# EasyEDA Pro project WS2811-22_2024-06-16.epro

# Schematic Schematic1
Create Date: 2024-06-16; Page Name: P1; Project Name: RGB22; Schematic Name: Schematic1; Update Date: 2024-06-16; Company: 嘉立创EDA; Page Size: A4; Version: V1.0
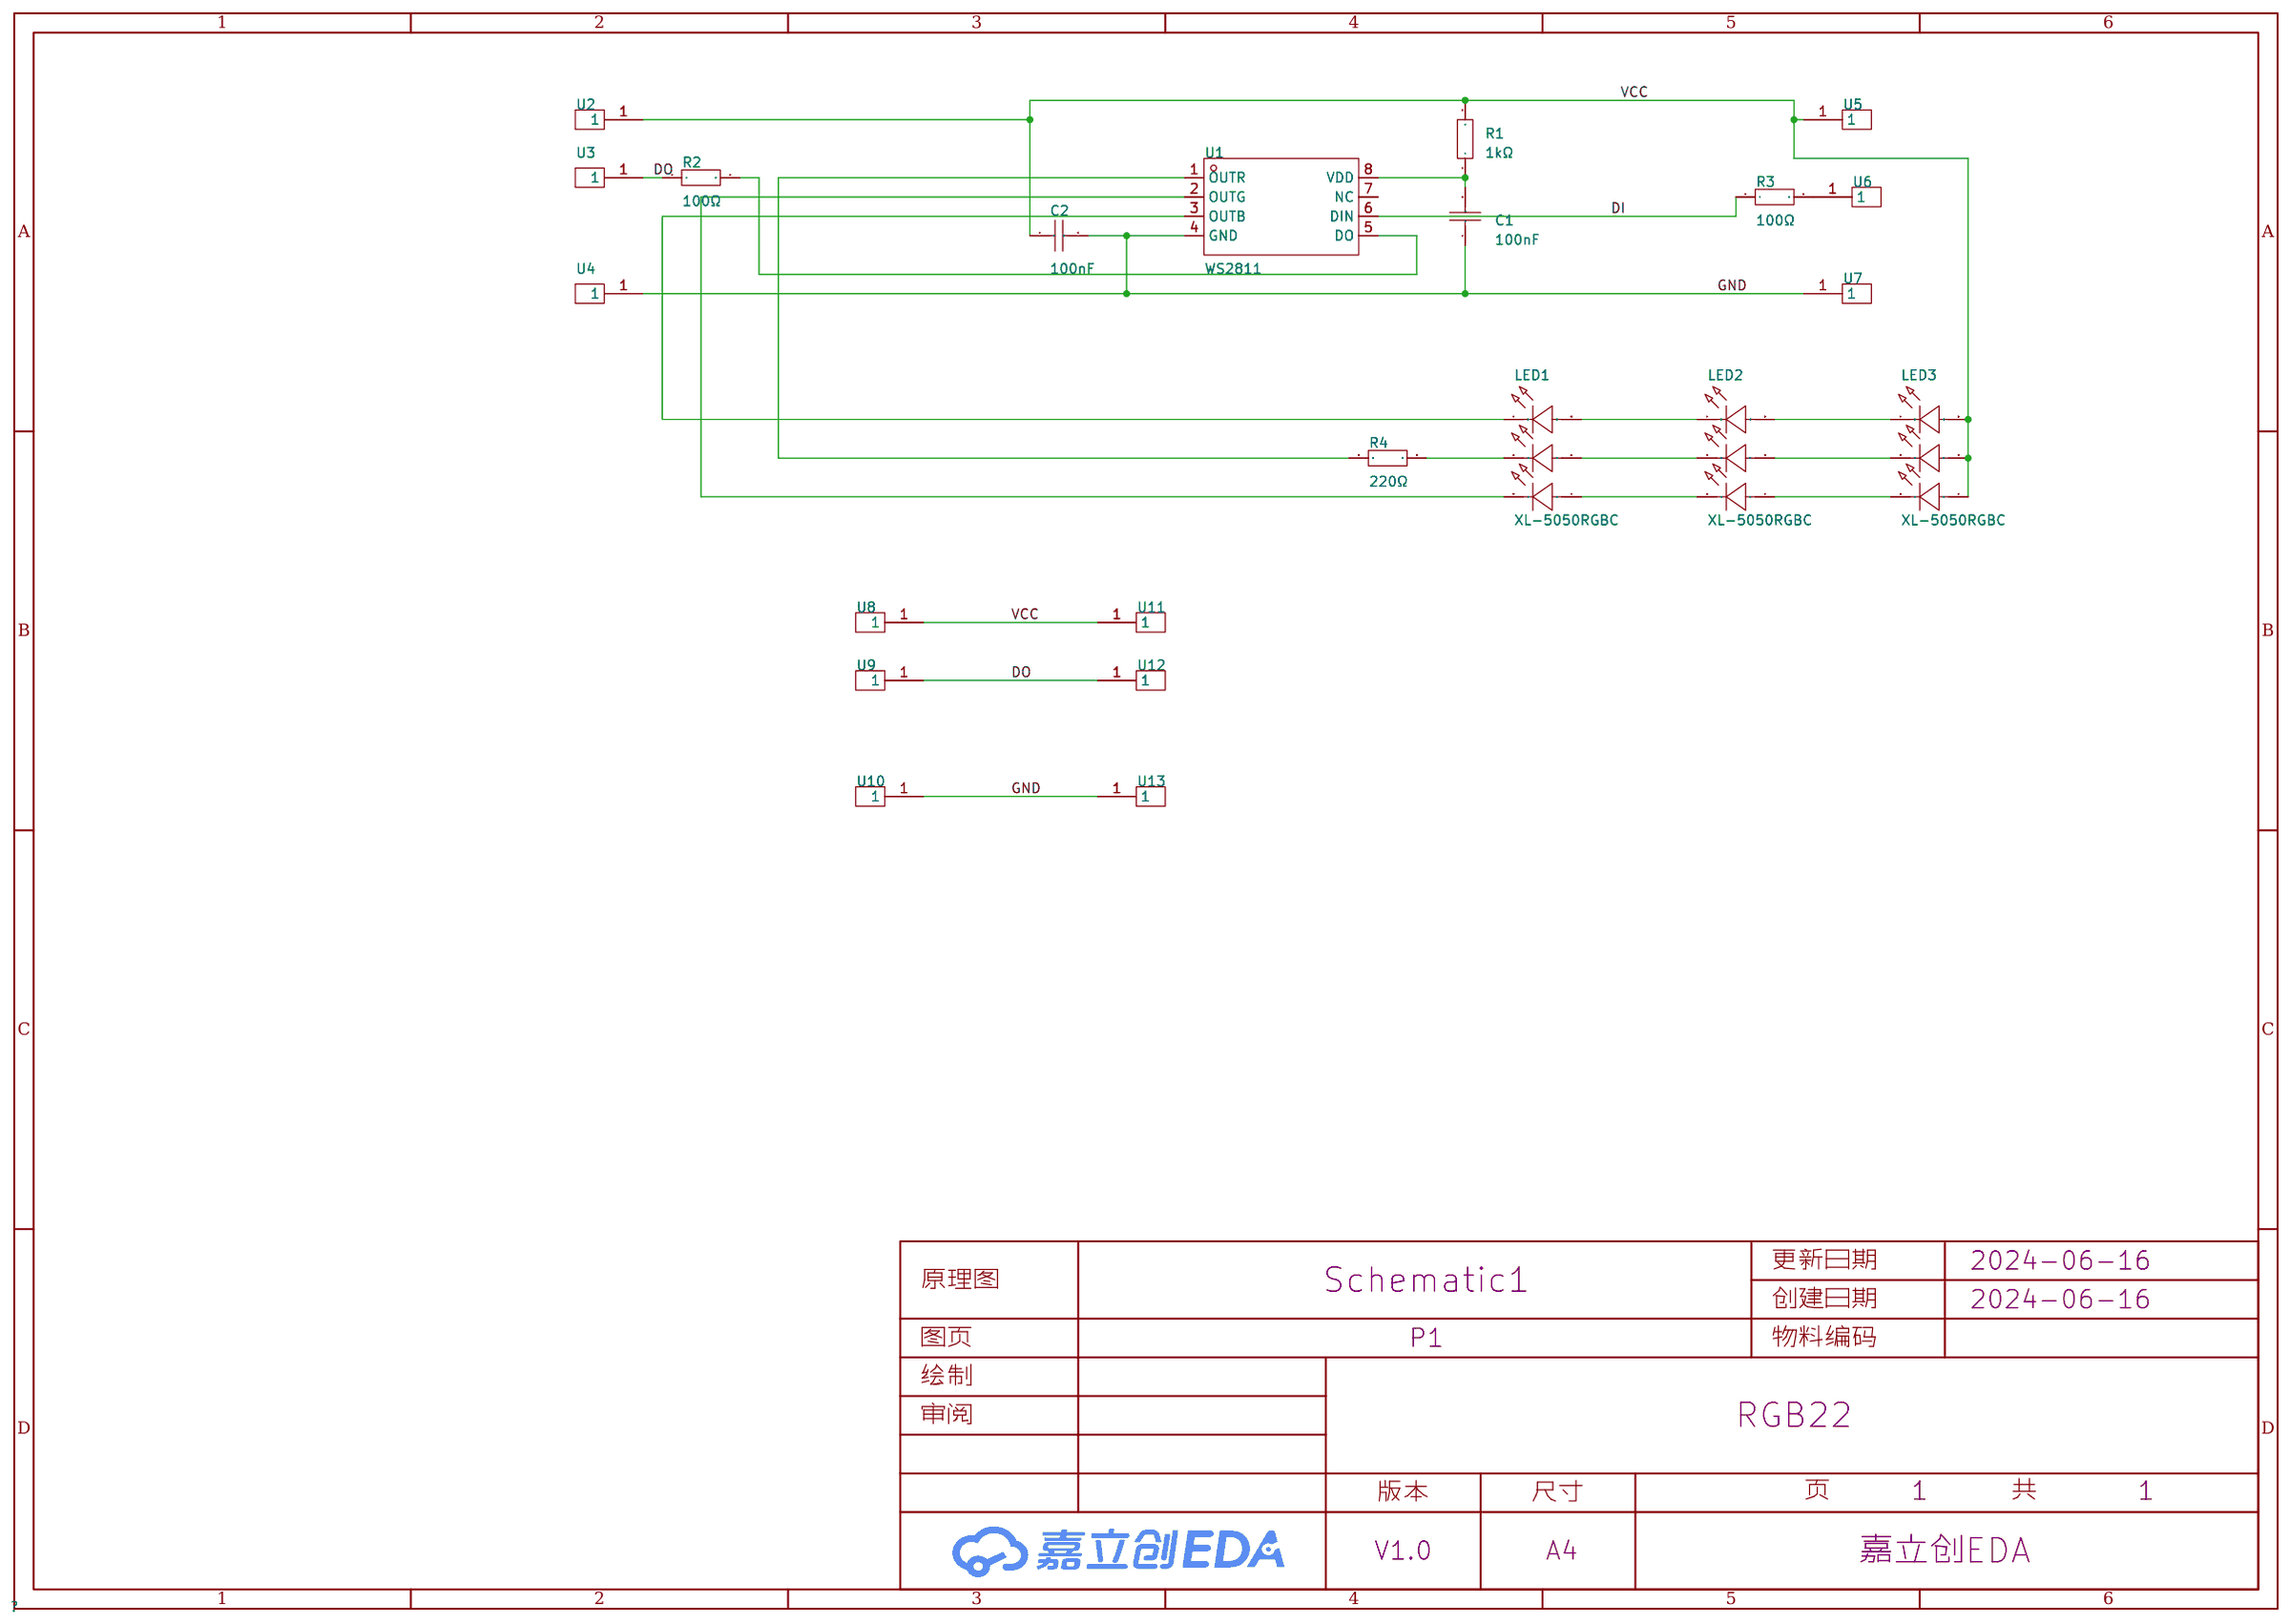
[diagram p0: schematic sheet]

## Parts
C1  100nF  [C0805]
C2  100nF  [C0805]
LED1  XL-5050RGBC  [LED-ARRAY-SMD_6P-L5.0-W5.0-TL-RD_3]
LED2  XL-5050RGBC  [LED-ARRAY-SMD_6P-L5.0-W5.0-TL-RD_3]
LED3  XL-5050RGBC  [LED-ARRAY-SMD_6P-L5.0-W5.0-TL-RD_3]
R1  1kΩ  [R0805]
R2  100Ω  [R0805]
R3  100Ω  [R0805]
R4  220Ω  [R0805]
U1  WS2811  [SOP-8_L4.9-W3.9-P1.27-LS6.0-BL]
U2  -  [1.7X9]
U3  -  [1.7X9]
U4  -  [1.7X9]
U5  -  [1.7X9]
U6  -  [1.7X9]
U7  -  [1.7X9]
U8  -  [1.7X9]
U9  -  [1.7X9]
U10  -  [1.7X9]
U11  -  [1.7X9]
U12  -  [1.7X9]
U13  -  [1.7X9]

## Library data of the parts
C1 C2 = CC0805KRX7R9BB104: 容值:100nF;精度:±10%;额定电压:50V;材质(温度系数):X7R;; LCSC Part Name: 100nF ±10% 50V; Supplier Part: C49678; Manufacturer: YAGEO(国巨); Supplier Footprint: 0805; JLCPCB Part Class: 基础库; Datasheet: https://atta.szlcsc.com/upload/public/pdf/source/20180224/C181747_15194369449651363981.pdf; Supplier: LCSC; Tolerance: ±10%; Voltage Rated: 50V; Temperature Coefficient: X7R
LED1-LED3 = XL-5050RGBC: Supplier Part: C2843868; Manufacturer: XINGLIGHT(成兴光); Supplier Footprint: SMD5050; JLCPCB Part Class: 扩展库; Datasheet: https://atta.szlcsc.com/upload/public/pdf/source/20240218/CABDF70070FCD907AD1288F8B8C45105.pdf; Supplier: LCSC
R1 = RC0805FR-071KL: 电阻类型:厚膜电阻;阻值:1kΩ;精度:±1%;功率:125mW;最大工作电压:150V;温度系数:±100ppm/℃;; LCSC Part Name: 厚膜电阻 1kΩ ±1% 125mW; Supplier Part: C95781; Manufacturer: YAGEO(国巨); Supplier Footprint: 0805; JLCPCB Part Class: Extended Part; Datasheet: https://atta.szlcsc.com/upload/public/pdf/source/20170708/1499509500945.pdf; Supplier: LCSC; Type: 厚膜电阻; Tolerance: ±1%; Power(Watts): 125mW; Overload Voltage (Max): 150V; Temperature Coefficient: ±100ppm/℃; Operating Temperature Range: -55℃~+155℃
R2 R3 = 0805W8F1000T5E: 电阻类型:厚膜电阻;阻值:100Ω;精度:±1%;功率:125mW;最大工作电压:150V;温度系数:±100ppm/℃;; LCSC Part Name: 100Ω ±1% 125mW 厚膜电阻; Supplier Part: C17408; Manufacturer: UNI-ROYAL(厚声); Supplier Footprint: 0805; JLCPCB Part Class: Basic Part; Datasheet: https://atta.szlcsc.com/upload/public/pdf/source/20200306/C422600_1E6D84923E4A46A82E41ADD87F860B5C.pdf; Supplier: LCSC; Type: 厚膜电阻; Tolerance: ±1%; Power(Watts): 125mW; Overload Voltage (Max): 150V; Temperature Coefficient: ±100ppm/℃; Operating Temperature Range: -55℃~+155℃
R4 = 0805W8F2200T5E: 电阻类型:厚膜电阻;阻值:220Ω;精度:±1%;功率:125mW;最大工作电压:150V;温度系数:±100ppm/℃;; LCSC Part Name: 220Ω ±1% 125mW 厚膜电阻; Supplier Part: C17557; Manufacturer: UNI-ROYAL(厚声); Supplier Footprint: 0805; JLCPCB Part Class: Basic Part; Datasheet: https://atta.szlcsc.com/upload/public/pdf/source/20200306/C422600_1E6D84923E4A46A82E41ADD87F860B5C.pdf; Supplier: LCSC; Type: 厚膜电阻; Tolerance: ±1%; Power(Watts): 125mW; Overload Voltage (Max): 150V; Temperature Coefficient: ±100ppm/℃; Operating Temperature Range: -55℃~+155℃
U1 = WS2811: 类型:-;输入电压:-;开关频率:-;通道数:-;输出电压:-;输出电流:-;调光:-;拓扑结构:-;; Supplier Part: C114581; Manufacturer: worldsemi; Supplier Footprint: SOP-8; JLCPCB Part Class: 扩展库; Datasheet: https://atta.szlcsc.com/upload/public/pdf/source/20180423/C114581_D7EB4F7619FBAA371B1B7B79DFB248AC.pdf; Supplier: LCSC
U2-U13 = 1P1.7X9.5

## Nets
GND: C1.1 C2.2 U1.4(GND) U4.1 U7.1 U10.1 U13.1
VCC: C2.1 LED3.4(G+) LED3.5(R+) LED3.6(B+) R1.2 U2.1 U5.1 U8.1 U11.1
DI: R3.1 U1.6(DIN)
DO: R2.1 U3.1 U9.1 U12.1
$1N814: C1.2 R1.1 U1.8(VDD)
$1N864: LED2.4(G+) LED3.3(G-)
$1N866: LED2.6(B+) LED3.1(B-)
$1N870: R3.2 U6.1
$1N876: LED1.1(B-) U1.3(OUTB)
$1N880: LED1.3(G-) U1.2(OUTG)
$1N884: LED1.6(B+) LED2.1(B-)
$1N886: LED1.4(G+) LED2.3(G-)
$1N892: LED1.5(R+) LED2.2(R-)
$1N898: R2.2 U1.5(DO)
$1N959: LED2.5(R+) LED3.2(R-)
$1N1028: R4.1 U1.1(OUTR)
$1N1029: LED1.2(R-) R4.2

Not connected (* = marked no-connect by the designer): U1 7(NC)

# Board PCB1
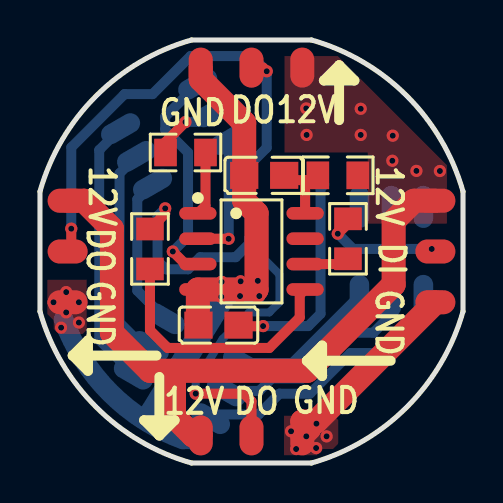
[diagram p1: board, top side]
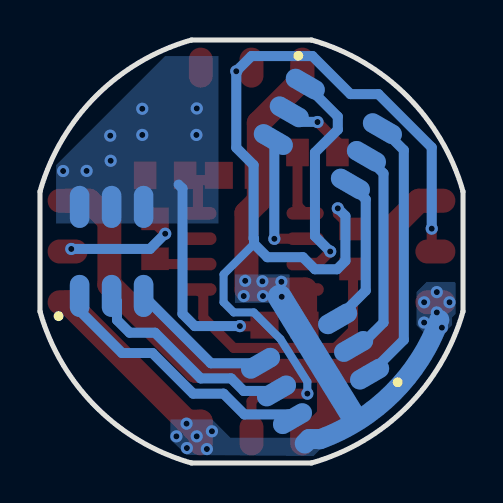
[diagram p2: board, bottom side, seen from below]

Outline 21.17 x 21.17 mm; copper layers: Top Layer, Bottom Layer. Coordinates in mm from the lower left corner of the outline.
Outline path: 0,13.58 arc(2.8,18.36) 7.58,21.17 13.58,21.17 arc(18.36,18.36) 21.17,13.58 21.17,7.58 arc(18.36,2.8) 13.58,0 7.58,0 arc(2.8,2.8) 0,7.58 0,13.58
Stack: Top Layer 0.035mm / Dielectric1 1.51mm FR4 er 4.5 / Bottom Layer 0.035mm

## Design rules (mm)
template: JLCPCB Capability(Two Layers Board)
spacing copperThickness1oz (default): track to track 0.102, other pairs 0.152 to 0.3
spacing copperThickness2oz: track to track 0.203, other pairs 0.152 to 0.3
track width copperThickness1oz (default): min 0.127, default 0.254, max 2.54
track width copperThickness2oz: min 0.203, default 0.254, max 2.54
differential pair differentialPair (default): width min 0.127, default 0.254, max 2.54; gap min 0.152, default 0.152
via viaSize (default): diameter min 0.5, default 0.61, max 10; hole min 0.3, default 0.305, max 6.3

## Placement (name value [footprint] x y rotation side)
C1  100nF  [C0805]  11.22 14.39 0 top
C2  100nF  [C0805]  8.93 6.9 180 top
LED1  XL-5050RGBC  [LED-ARRAY-SMD_6P-L5.0-W5.0-TL-RD_3]  6.76 16.46 210 bottom
LED2  XL-5050RGBC  [LED-ARRAY-SMD_6P-L5.0-W5.0-TL-RD_3]  7.4 4.72 330 bottom
LED3  XL-5050RGBC  [LED-ARRAY-SMD_6P-L5.0-W5.0-TL-RD_3]  17.58 10.59 90 bottom
R1  1kΩ  [R0805]  14.9 14.39 0 top
R2  100Ω  [R0805]  5.5 10.71 270 top
R3  100Ω  [R0805]  15.41 11.22 90 top
R4  220Ω  [R0805]  7.28 15.54 180 top
U1  WS2811  [SOP-8_L4.9-W3.9-P1.27-LS6.0-BL]  10.58 10.59 270 top
U2  -  [1.7X9]  1.38 13.12 90 top
U3  -  [1.7X9]  1.38 10.58 90 top
U4  -  [1.7X9]  1.38 8.04 90 top
U5  -  [1.7X9]  19.78 13.12 90 top
U6  -  [1.7X9]  19.78 10.58 90 top
U7  -  [1.7X9]  19.78 8.04 90 top
U8  -  [1.7X9]  8.04 1.38 180 top
U9  -  [1.7X9]  10.58 1.38 180 top
U10  -  [1.7X9]  13.12 1.38 180 top
U11  -  [1.7X9]  13.12 19.78 0 top
U12  -  [1.7X9]  10.58 19.78 0 top
U13  -  [1.7X9]  8.04 19.78 0 top

## Footprints (pads in the part's own frame, mm; a bottom-side part is the same pattern mirrored in y, then rotated)
1.7X9
  oval 1.2x2 smd: 1(0,0)
C0805
  rect 1.41x1.35 smd: 1(-1,0) 2(1,0)
LED-ARRAY-SMD_6P-L5.0-W5.0-TL-RD_3
  oval 2.105x0.98 smd: 1(-2.228,1.6) 2(-2.228,0) 3(-2.228,-1.6) 4(2.228,-1.6) 5(2.228,0) 6(2.228,1.6)
R0805
  rect 1.133x1.377 smd: 1(-1,0) 2(1,0)
SOP-8_L4.9-W3.9-P1.27-LS6.0-BL
  oval 0.63x1.865 smd: 1(-1.905,-2.683) 2(-0.635,-2.683) 3(0.635,-2.683) 4(1.905,-2.683) 5(1.905,2.683) 6(0.635,2.683) 7(-0.635,2.683) 8(-1.905,2.683)

## Nets
As in the schematic.

Pads without a net: U1 7

## Via types
v1: diameter 0.61, hole 0.305, Top Layer to Bottom Layer, 36 vias

## Routing (per net, layer and track width the routed paths; a pad name or vN(x,y) marks a point on that pad's centre or on a via; arc(x,y) is an arc through that point)
GND: length 43.8
  Top Layer w1.2: U7.1 13.81,2.07 13.12,2.07 13.47,1.73 U10.1 ; C2.2 7.9,6.93 U1.4 10.84,8.68 10.84,12.5 10.22,13.12 C1.1 10.22,17.02 8.04,19.19 U13.1
  Bottom Layer w1: 7.16,1.19 arc(3.51,3.51) 1.19,7.16 ; 7.92,0.98 7.7,1.2 7.16,1.2
  Bottom Layer w1.2: 5.46,2.28 9.18,8.32
  vias: v1(0.68,8.04) v1(1.06,6.77) v1(1.31,8.55) v1(1.31,7.53) v1(1.95,8.04) v1(1.95,7.03) v1(9.09,9.07) v1(9.07,8.32) v1(10.01,8.35) v1(10.04,9.09) v1(10.9,9.12) v1(10.97,8.35) v1(12.56,1.59) v1(12.82,0.7) v1(13.32,1.33) v1(13.83,1.97) v1(13.82,0.75) v1(14.34,1.33)
VCC: length 45.3
  Top Layer w0.5: v1(11.16,6.85) 11.15,6.84 9.9,6.84
  Top Layer w1.2: 6.71,4.61 6.71,2.33 7.65,1.38 U8.1 ; 6.71,4.61 5.5,4.61 3.6,6.52 3.6,11.73 2.2,13.12 U2.1 ; 6.71,4.61 13.38,4.61 17.69,8.93 17.69,12.11 18.71,13.12 U5.1
  Bottom Layer w0.5: v1(11.16,6.85) 13.42,6.85 14.04,7.46 14.04,13.74 14.23,13.93
  vias: v1(13.32,17.74) v1(13.34,16.41) v1(16.05,17.72) v1(16.05,16.41) v1(17.63,15.12) v1(17.65,16.38) v1(18.83,14.62) v1(20.01,14.61)
DI: length 2.3
  Top Layer w0.5: U1.6 15.14,9.95 R3.1
DO: length 51.7
  Top Layer w0.5: R2.1 6.26,12.47 v1(6.26,12.74) ; v1(1.57,11.73) 1.57,10.77 U3.1 ; v1(11.34,19.6) 11.16,19.78 U12.1 ; v1(7.79,3.47) 10.2,3.47 10.58,3.09 U9.1
  Bottom Layer w0.4: 10.48,11.24 10.48,10.94 11.98,9.44 11.98,8.04 11.47,7.53 10.47,7.53 9.13,6.2 7.79,4.07 v1(7.79,3.47)
  Bottom Layer w0.5: v1(1.57,11.73) 1.57,15.79 4.23,18.46 5.63,18.46 7.53,20.36 10.58,20.36 v1(11.34,19.6) 11.34,15.78 10.48,14.91 10.48,11.24 10.46,11.22 10.46,10.96 9.79,10.3 8.01,10.3 7.41,9.69 6.31,9.69 5.88,10.11 5.88,12.36 v1(6.26,12.74)
$1N814: length 3.3
  Top Layer w0.5: 14.16,14.14 14.14,14.16 13.26,14.16 ; 13.26,14.16 12.49,14.16 ; 13.26,14.16 U1.8
$1N864: length 7.2
  Bottom Layer w0.5: 10.13,4.99 12.61,4.99 15.98,8.36
$1N866: length 13.6
  Bottom Layer w0.5: 8.53,2.22 8.74,2.43 10.94,2.43 11.98,3.47 13.5,3.47 15.54,5.5 17.06,5.5 19.18,7.63 19.18,8.36
$1N870: length 6
  Top Layer w0.5: R3.2 15.41,11.98 v1(14.9,11.47)
  Bottom Layer w0.5: v1(19.6,10.71) 15.66,10.71 v1(14.9,11.47)
$1N876: length 11.4
  Top Layer w0.5: v1(6.65,10.58) 7.28,9.95 U1.3
  Bottom Layer w0.5: v1(6.65,10.58) 7.41,11.34 7.41,15.54 6.26,16.68 6.26,17.33 LED1.1
$1N880: length 6.5
  Top Layer w0.5: v1(9.44,11.22) 9.44,11.22 U1.2
  Bottom Layer w0.5: v1(9.44,11.22) 9.44,16.13 9.49,16.18
$1N884: length 13.4
  Bottom Layer w0.5: LED1.6 2.96,15.66 2.96,6.16 4.67,4.45
$1N886: length 7.6
  Bottom Layer w0.5: LED1.4 4.87,13.19 4.87,8.62 6.27,7.22
$1N892: length 10.7
  Bottom Layer w0.5: LED1.5 3.98,14.49 3.98,7.03 5.17,5.83 5.47,5.83
$1N898: length 13.1
  Top Layer w0.5: U1.5 13,8.41 13,7.28 11.47,5.76 6.39,5.76 5.5,6.65 R2.2
$1N959: length 10.8
  Bottom Layer w0.5: 9.33,3.61 10.97,3.61 11.6,4.23 13.12,4.23 15.41,6.52 16.68,6.52 17.31,7.15 17.31,8.09 17.58,8.36
$1N1028: length 3.2
  Top Layer w0.5: U1.1 8.28,12.87 R4.1
$1N1029: length 3.6
  Top Layer w0.5: v1(7.28,17.06) 6.28,16.06 R4.2
  Bottom Layer w0.5: v1(7.28,17.06) 7.29,17.07 8.19,17.07 8.69,17.57

## Copper pours and planes (outline as drawn; the poured copper is in the pictures)
GND on Top Layer: 0.37,9.17 2.34,9.17 2.34,6.46 0.37,6.46
GND on Top Layer: 12.21,2.36 14.92,2.36 14.92,0.39 12.21,0.39
GND on Bottom Layer: 0.37,9.06 2.33,9.06 2.33,6.52 0.37,6.52
GND on Bottom Layer: 7.11,2.18 14.64,2.18 14.64,0.35 7.11,0.35
GND on Bottom Layer: 8.68,9.44 11.41,9.44 11.41,8.01 8.68,8.01
VCC on Top Layer: 12.23,20.36 20.36,20.36 20.36,11.98 12.23,11.98
VCC on Bottom Layer: 12.23,20.36 20.36,20.36 20.36,11.98 12.23,11.98

## Text on the board
Top Silkscreen Layer: GND | 12V | DO | DI
